# Altium schematic sheet CRM100.SchDoc
size A4
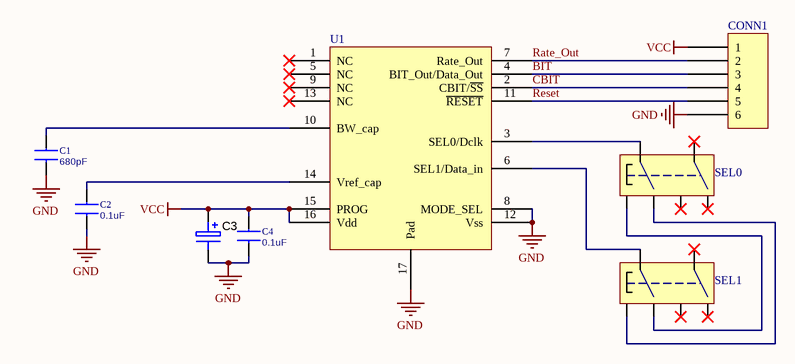
[diagram p0: CRM100.SchDoc]

## Parts
C1  680pF  [C_0805]
C2  0.1uF  [C_0805]
C3  (no value)  [CAPMP3216X180N]
C4  0.1uF  [C_0805]
CONN1  6_pin_plate_conn  [6_pin_plate_conn]  (value not drawn)
SEL0  IS-1390 switch  [IS1390]  (value not drawn)
SEL1  IS-1390 switch  [IS1390]  (value not drawn)
U1  CRM100 gyroscope  [CRM100]  (value not drawn)

## Nets
GND: C1.1 C2.1 C3.2 C4.1 CONN1.6 U1.8(MODE_SEL) U1.12(Vss) U1.17(Pad)
VCC: C3.1 C4.2 CONN1.1 U1.15(PROG) U1.16(Vdd)
BIT: CONN1.3 U1.4(BIT_Out/Data_Out)
CBIT: CONN1.4 U1.2(CBIT/~{SS})
Rate_Out: CONN1.2 U1.7(Rate_Out)
Reset: CONN1.5 U1.11(~{RESET})
NetC1_2: C1.2 U1.10(BW_cap)
NetC2_2: C2.2 U1.14(Vref_cap)
NetSEL0_4: SEL0.4 SEL1.6
NetSEL0_5: SEL0.5 U1.3(SEL0/Dclk)
NetSEL0_6: SEL0.6 SEL1.4
NetSEL1_5: SEL1.5 U1.6(SEL1/Data_in)

Not connected (* = marked no-connect by the designer): SEL0 1* 2* 3*; SEL1 1* 2* 3*; U1 1(NC)* 5(NC)* 9(NC)* 13(NC)*

## Library data of the parts
C1 C2 C4 = C0805: Capacitor
  C1: Value: 680pF
  C2 C4: Value: 0.1uF
C3 = CAP_TANT_TYPE_A: Capacitor SMD Tantalum 4.7uF 10% 16V 3216-18; Manufacturer 1: Vishay/Sprague; Manufacturer Part Number 1: 293D475X9016A2TE3; SCDType: undef; Package / Case: EIA 535BAAC size A; Ratings: 16V; Tolerance: ±10%; Material: Tantalum; Supplier 1: Digi-Key; Supplier Part Number 1: 718-1148-1-ND
SEL0 SEL1 = IS-1390
U1 = CRM100